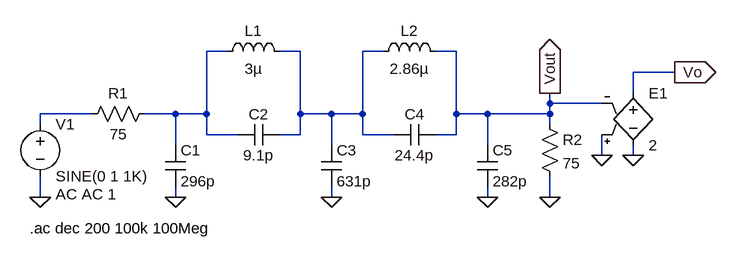
[diagram p0: schematic Elliptic filter.asc]
Elliptic filter.asc, the LTspice schematic file:
Version 4
SHEET 1 1188 680
WIRE 368 32 336 32
WIRE 480 32 448 32
WIRE 608 32 576 32
WIRE 720 32 688 32
WIRE 1056 64 992 64
WIRE 992 96 992 64
WIRE 864 112 864 96
WIRE 944 112 864 112
WIRE 160 128 80 128
WIRE 288 128 240 128
WIRE 336 128 336 32
WIRE 336 128 288 128
WIRE 480 128 480 32
WIRE 528 128 480 128
WIRE 576 128 576 32
WIRE 576 128 528 128
WIRE 720 128 720 32
WIRE 768 128 720 128
WIRE 864 128 864 112
WIRE 864 128 768 128
WIRE 80 144 80 128
WIRE 864 144 864 128
WIRE 336 160 336 128
WIRE 384 160 336 160
WIRE 480 160 480 128
WIRE 480 160 448 160
WIRE 576 160 576 128
WIRE 624 160 576 160
WIRE 720 160 720 128
WIRE 720 160 688 160
WIRE 288 176 288 128
WIRE 528 176 528 128
WIRE 768 176 768 128
WIRE 944 192 944 160
WIRE 992 192 992 176
WIRE 80 256 80 224
WIRE 288 256 288 240
WIRE 528 256 528 240
WIRE 768 256 768 240
WIRE 864 256 864 224
FLAG 80 256 0
FLAG 288 256 0
FLAG 528 256 0
FLAG 768 256 0
FLAG 864 256 0
FLAG 944 192 0
FLAG 992 192 0
FLAG 864 96 Vout
IOPIN 864 96 Out
FLAG 1056 64 Vo
IOPIN 1056 64 Out
SYMBOL voltage 80 128 R0
WINDOW 123 24 124 Left 2
WINDOW 39 0 0 Left 0
SYMATTR Value2 AC AC 1
SYMATTR InstName V1
SYMATTR Value SINE(0 1 1K)
SYMBOL res 256 112 R90
WINDOW 0 0 56 VBottom 2
WINDOW 3 32 56 VTop 2
SYMATTR InstName R1
SYMATTR Value 75
SYMBOL cap 272 176 R0
SYMATTR InstName C1
SYMATTR Value 296p
SYMBOL cap 448 144 R90
WINDOW 0 0 32 VBottom 2
WINDOW 3 32 32 VTop 2
SYMATTR InstName C2
SYMATTR Value 9.1p
SYMBOL ind 352 48 R270
WINDOW 0 32 56 VTop 2
WINDOW 3 5 56 VBottom 2
SYMATTR InstName L1
SYMATTR Value 3µ
SYMBOL cap 512 176 R0
SYMATTR InstName C3
SYMATTR Value 631p
SYMBOL cap 688 144 R90
WINDOW 0 0 32 VBottom 2
WINDOW 3 32 32 VTop 2
SYMATTR InstName C4
SYMATTR Value 24.4p
SYMBOL ind 592 48 R270
WINDOW 0 32 56 VTop 2
WINDOW 3 5 56 VBottom 2
SYMATTR InstName L2
SYMATTR Value 2.86µ
SYMBOL cap 752 176 R0
SYMATTR InstName C5
SYMATTR Value 282p
SYMBOL res 848 128 R0
SYMATTR InstName R2
SYMATTR Value 75
SYMBOL e2 992 80 R0
SYMATTR InstName E1
SYMATTR Value 2
TEXT 64 304 Left 2 !.ac dec 200 100k 100Meg

The netlist it stands for:
* Elliptic filter.asc
V1 N003 0 SINE(0 1 1K) AC AC 1
R1 N001 N003 75
C1 N001 0 296p
C2 N002 N001 9.1p
L1 N001 N002 3µ
C3 N002 0 631p
C4 Vout N002 24.4p
L2 N002 Vout 2.86µ
C5 Vout 0 282p
R2 Vout 0 75
E1 Vo 0 0 Vout 2
.ac dec 200 100k 100Meg
.backanno
.end

* Results of the author's LTspice run, read from the files saved beside the schematic
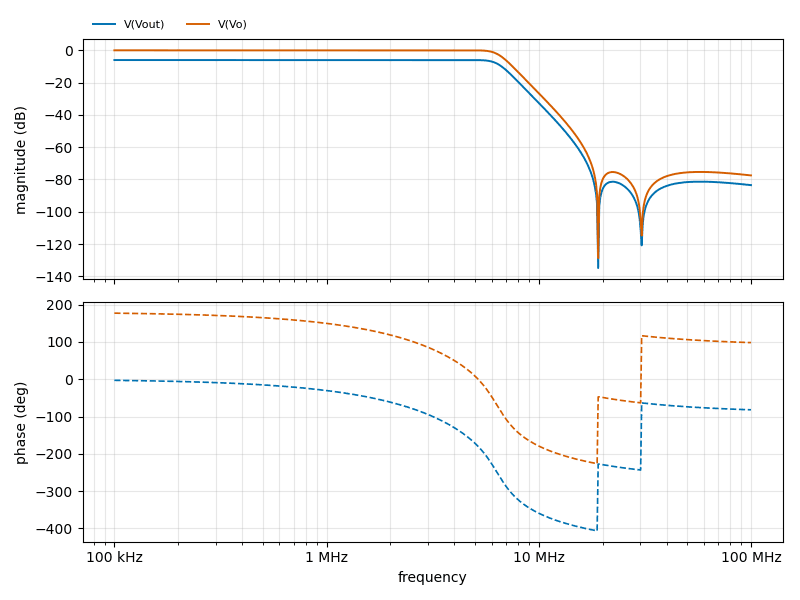
[diagram p1: AC Analysis of Elliptic filter.asc, plotted from the saved traces]
* AC Analysis, 1 run:
*   V(Vout): -6.02 dB at 100 kHz, -83.51 dB at 100 MHz, peak -6.02 dB at 2.985 MHz, 3 dB below the peak at 6.514 MHz
*   V(Vo): -0.00 dB at 100 kHz, -77.49 dB at 100 MHz, peak -0.00 dB at 2.985 MHz, 3 dB below the peak at 6.514 MHz